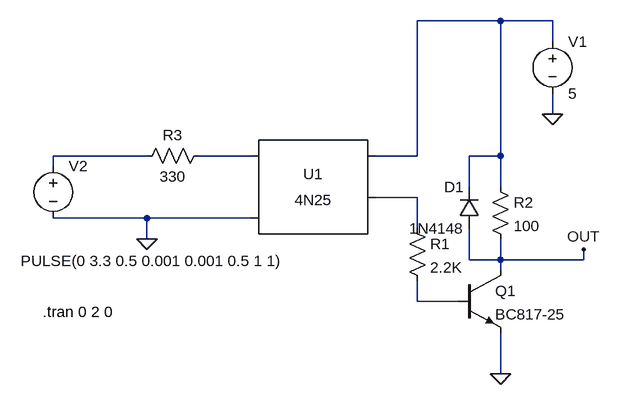
[diagram p0: schematic salidasReles.asc]
salidasReles.asc, the LTspice schematic file:
Version 4
SHEET 1 880 680
WIRE 544 -32 416 -32
WIRE 624 -32 544 -32
WIRE 624 0 624 -32
WIRE 624 112 624 80
WIRE 0 176 -144 176
WIRE 160 176 80 176
WIRE 416 176 416 -32
WIRE 416 176 352 176
WIRE 544 176 544 -32
WIRE 544 176 496 176
WIRE -144 192 -144 176
WIRE 496 224 496 176
WIRE 544 224 544 176
WIRE 416 240 352 240
WIRE 0 272 -144 272
WIRE 160 272 0 272
WIRE 416 288 416 240
WIRE 0 304 0 272
WIRE 496 336 496 288
WIRE 544 336 544 304
WIRE 544 336 496 336
WIRE 672 336 672 320
WIRE 672 336 544 336
WIRE 544 352 544 336
WIRE 416 400 416 368
WIRE 480 400 416 400
WIRE 544 512 544 448
FLAG 624 112 0
FLAG 544 512 0
FLAG 672 320 OUT
FLAG 0 304 0
SYMBOL Optos/4N25 256 240 R0
SYMATTR InstName U1
SYMBOL npn 480 352 R0
SYMATTR InstName Q1
SYMATTR Value BC817-25
SYMBOL voltage 624 -16 R0
SYMATTR InstName V1
SYMATTR Value 5
SYMBOL res 400 272 R0
SYMATTR InstName R1
SYMATTR Value 2.2K
SYMBOL res 528 208 R0
SYMATTR InstName R2
SYMATTR Value 100
SYMBOL res 96 160 R90
WINDOW 0 0 56 VBottom 2
WINDOW 3 32 56 VTop 2
SYMATTR InstName R3
SYMATTR Value 330
SYMBOL voltage -144 176 R0
WINDOW 3 -50 162 Left 2
SYMATTR Value PULSE(0 3.3 0.5 0.001 0.001 0.5 1 1)
SYMATTR InstName V2
SYMBOL diode 512 288 R180
WINDOW 0 24 64 Left 2
WINDOW 3 24 0 Left 2
SYMATTR InstName D1
SYMATTR Value 1N4148
TEXT -160 416 Left 2 !.tran 0 2 0

The netlist it stands for:
* salidasReles.asc
XU1 N003 0 N001 N004 NC_01 4N25
Q1 OUT N005 0 0 BC817-25
V1 N001 0 5
R1 N004 N005 2.2K
R2 N001 OUT 100
R3 N003 N002 330
V2 N002 0 PULSE(0 3.3 0.5 0.001 0.001 0.5 1 1)
D1 OUT N001 1N4148
.model D D
.lib standard.dio
.model NPN NPN
.model PNP PNP
.lib standard.bjt
.tran 0 2 0
.lib 4N25.sub
.backanno
.end